# Altium schematic sheet 2_外围电路.schdoc
size 497 x 243 mm; Name: A_A4; Symbol: A_A4; Device: A_A4; @Project Name: volume-adjuster-v1.0; REV: 1.0; Date: 2023-04-22; Sheet: 1/1; Draw By: wfei &amp; zzc; Company: Your Company; Convert to PCB: yes; Add into BOM: yes; SheetNumber: 2; SheetTotal: 2
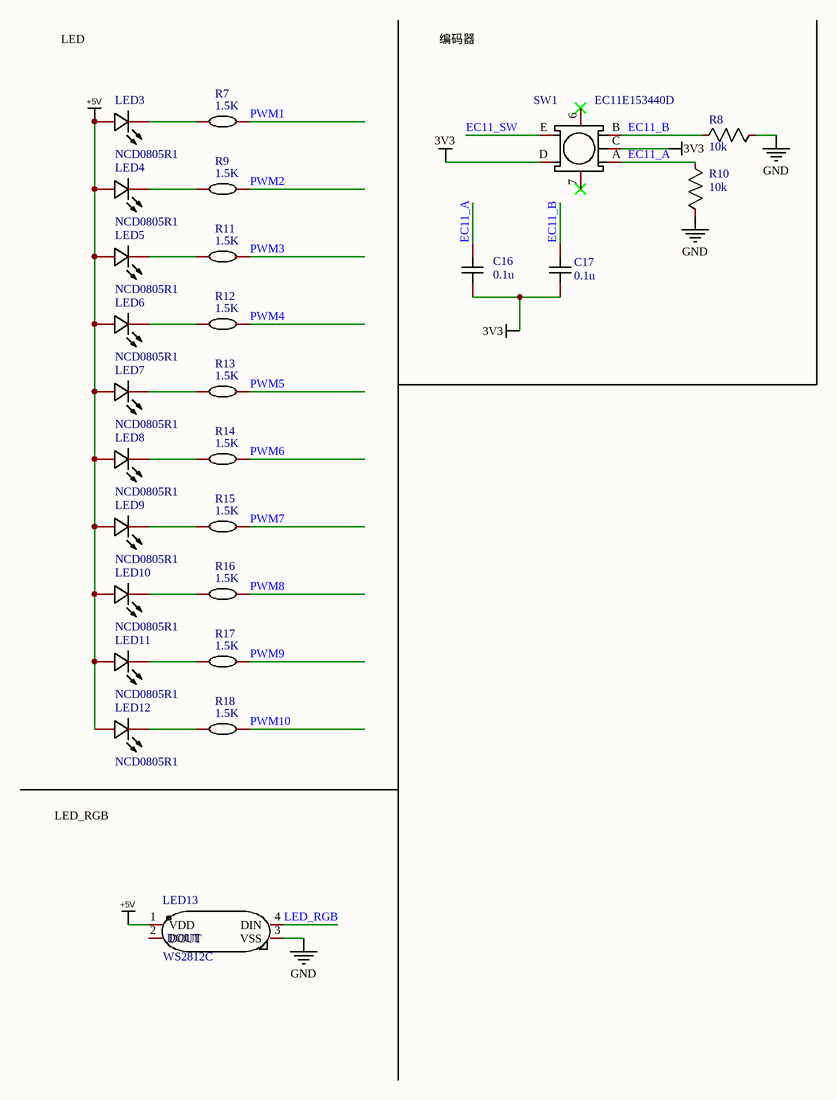
[diagram p0: 2_外围电路.schdoc]

## Parts
C16  0.1u  [C0805]
C17  0.1u  [C0805]
LED3  NCD0805R1  [LED0805-RD_RED]
LED4  NCD0805R1  [LED0805-RD_RED]
LED5  NCD0805R1  [LED0805-RD_RED]
LED6  NCD0805R1  [LED0805-RD_RED]
LED7  NCD0805R1  [LED0805-RD_RED]
LED8  NCD0805R1  [LED0805-RD_RED]
LED9  NCD0805R1  [LED0805-RD_RED]
LED10  NCD0805R1  [LED0805-RD_RED]
LED11  NCD0805R1  [LED0805-RD_RED]
LED12  NCD0805R1  [LED0805-RD_RED]
LED13  NAME: DOUT  [LED-SMD_4P-L5.0-W5.0-LS5.4-TL-1]  (hidden comment: WS2812C)
R7  1.5K  [R0805]
R8  10k  [R0805]
R9  1.5K  [R0805]
R10  10k  [R0805]
R11  1.5K  [R0805]
R12  1.5K  [R0805]
R13  1.5K  [R0805]
R14  1.5K  [R0805]
R15  1.5K  [R0805]
R16  1.5K  [R0805]
R17  1.5K  [R0805]
R18  1.5K  [R0805]
SW1  EC11E153440D  [SW-TH_EC11XXXXXXXX]

## Nets
3V3: C16.1 C17.1 SW1.C SW1.D
+5V: LED3.2(+) LED4.2(+) LED5.2(+) LED6.2(+) LED7.2(+) LED8.2(+) LED9.2(+) LED10.2(+) LED11.2(+) LED12.2(+) LED13.1(VDD)
GND: LED13.3(VSS) R8.1 R10.2
EC11_A: C16.2 R10.1 SW1.A
EC11_B: C17.2 R8.2 SW1.B
EC11_SW: SW1.E
LED_RGB: LED13.4(DIN)
PWM1: R7.2
PWM2: R9.2
PWM3: R11.2
PWM4: R12.2
PWM5: R13.2
PWM6: R14.2
PWM7: R15.2
PWM8: R16.2
PWM9: R17.2
PWM10: R18.2
NetLED3_1: LED3.1(-) R7.1
NetLED4_1: LED4.1(-) R9.1
NetLED5_1: LED5.1(-) R11.1
NetLED6_1: LED6.1(-) R12.1
NetLED7_1: LED7.1(-) R13.1
NetLED8_1: LED8.1(-) R14.1
NetLED9_1: LED9.1(-) R15.1
NetLED10_1: LED10.1(-) R16.1
NetLED11_1: LED11.1(-) R17.1
NetLED12_1: LED12.1(-) R18.1

Not connected (* = marked no-connect by the designer): LED13 2(DOUT); SW1 6* 7*

## Notes on the sheet
- LED
- 编码器
- LED_RGB
- 1
- 2
- 3
- 4
- 5
- A
- B
- C
- D
- TITLE:
- volume-adjuster-v1.0
- REV:
- 1.0
- Date:
- Company:
- 2023-04-22
- Your Company
- Drawn By:
- wfei &amp; zzc
- Sheet:
- 1/1

## Library data of the parts
C16 C17 = 0.1u: Convert to PCB: yes; Name: 0.1u; Symbol: 0.1u; Device: 0.1u; Add into BOM: yes; Origin Footprint: C0805
LED3-LED12 = NCD0805R1: 发光颜色:红灯;; Manufacturer: 国星光电; Symbol: FC-2012HRK-620D; Add into BOM: yes; Emitted Color: 红灯; Name: NCD0805R1; Device: NCD0805R1; LCSC Part Name: 红灯; Supplier Part: C84256; Manufacturer Part: NCD0805R1; Supplier Footprint: 0805; JLCPCB Part Class: Basic Part; Datasheet: https://atta.szlcsc.com/upload/public/pdf/source/20200820/C84256_F0A75A43B3EAD75808600A0514C76B99.pdf; Supplier: LCSC; Convert to PCB: yes
LED13 = WS2812C: 发光颜色:RGB三色;; Manufacturer: worldsemi; Add into BOM: yes; Emitted Color: RGB三色; Name: WS2812C; Symbol: WS2812C; Device: WS2812C; LCSC Part Name: RGB三色 （注意防潮，请查阅规格书中对应具体内容）; Supplier Part: C114587; Manufacturer Part: WS2812C; Supplier Footprint: SMD5050; JLCPCB Part Class: Extended Part; Datasheet: https://atta.szlcsc.com/upload/public/pdf/source/20171019/C114587_15083980074721044737.pdf; Supplier: LCSC; Convert to PCB: yes
R7 R9 R11-R18 = AC0805FR-071K5L: Manufacturer: YAGEO(国巨); Resistance: 1.5kΩ; Convert to PCB: yes; Name: 1.5K; Symbol: 1.5K; Device: AC0805FR-071K5L; Supplier: LCSC; Supplier Part: C144580; Manufacturer Part: AC0805FR-071K5L; JLCPCB Part Class: Extended Part; Add into BOM: yes; Origin Footprint: R0805
R8 R10 = 10k: Convert to PCB: yes; Name: 10k; Symbol: 10k; Device: 10k; Add into BOM: yes; Origin Footprint: R0805
SW1 = EC11E153440D: Manufacturer: ALPSALPINE(阿尔卑斯阿尔派); Add into BOM: yes; Name: EC11E153440D; Symbol: EC11E153440D; Device: EC11E153440D; LCSC Part Name: 编码器; Supplier Part: C370992; Manufacturer Part: EC11E153440D; Supplier Footprint: 插件; JLCPCB Part Class: Extended Part; Datasheet: https://atta.szlcsc.com/upload/public/pdf/source/20200526/C370992_95C13CAE7E7FAF27485295BD459A5993.pdf; Supplier: LCSC; Convert to PCB: yes